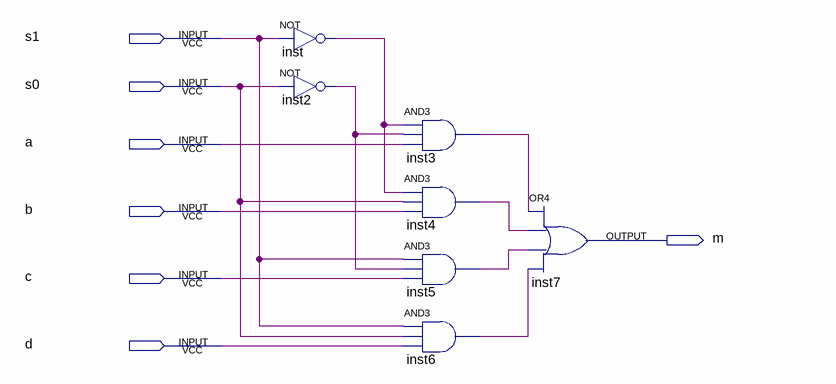
[diagram p0: schematic sheet]
// Quartus schematic MUX4_1_1BIT.bdf as structural Verilog: 7 symbols, 7 pins
module MUX4_1_1BIT (
  input  s1,
  input  s0,
  input  a,
  input  b,
  input  c,
  input  d,
  output m
);

  wire inst2_out, inst3_out, inst4_out, inst5_out, inst6_out, inst_out;

  not inst (inst_out, s1);
  not inst2 (inst2_out, s0);
  and inst3 (inst3_out, inst_out, inst2_out, a);
  and inst4 (inst4_out, inst_out, s0, b);
  and inst5 (inst5_out, s1, inst2_out, c);
  and inst6 (inst6_out, s1, s0, d);
  or inst7 (m, inst3_out, inst4_out, inst5_out, inst6_out);
endmodule
